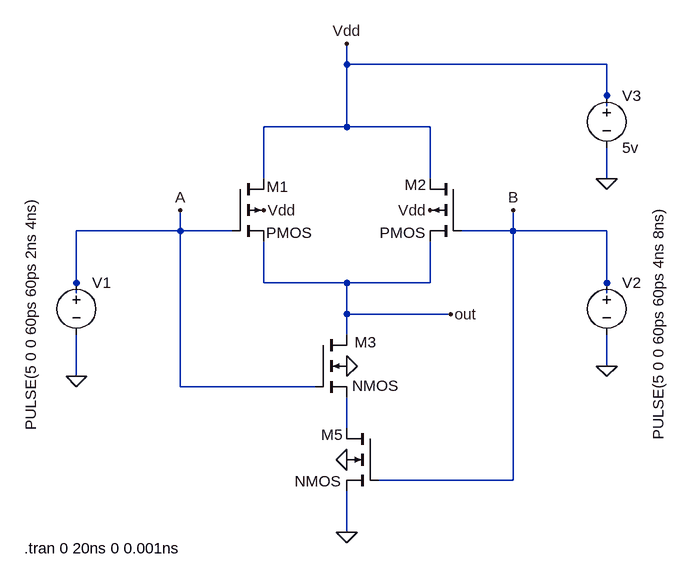
[diagram p0: schematic NAND.asc]
NAND.asc, the LTspice schematic file:
Version 4
SHEET 1 1016 740
WIRE 160 -80 160 -112
WIRE 560 -80 160 -80
WIRE 560 -32 560 -80
WIRE 560 -16 560 -32
WIRE 160 16 160 -80
WIRE 160 16 32 16
WIRE 288 16 160 16
WIRE 32 96 32 16
WIRE 288 96 288 16
WIRE 560 96 560 48
WIRE -96 176 -96 144
WIRE -96 176 -256 176
WIRE -16 176 -96 176
WIRE 416 176 416 144
WIRE 416 176 336 176
WIRE 560 176 416 176
WIRE -256 256 -256 176
WIRE 32 256 32 192
WIRE 160 256 32 256
WIRE 288 256 288 192
WIRE 288 256 160 256
WIRE 560 256 560 176
WIRE -256 272 -256 256
WIRE 560 272 560 256
WIRE 160 304 160 256
WIRE 320 304 160 304
WIRE 160 336 160 304
WIRE 560 384 560 336
WIRE -256 400 -256 336
WIRE -96 416 -96 176
WIRE 112 416 -96 416
WIRE 160 480 160 432
WIRE 416 560 416 176
WIRE 416 560 208 560
WIRE 160 640 160 576
FLAG 160 640 0
FLAG 560 384 0
FLAG -256 400 0
FLAG 160 -112 Vdd
FLAG 32 144 Vdd
FLAG 288 144 Vdd
FLAG -96 144 A
FLAG 416 144 B
FLAG 560 96 0
FLAG 160 384 0
FLAG 160 528 0
FLAG 320 304 out
SYMBOL voltage -256 240 R0
WINDOW 3 -70 -116 VRight 2
WINDOW 123 0 0 Left 0
WINDOW 39 0 0 Left 0
SYMATTR Value PULSE(5 0 0 60ps 60ps 2ns 4ns)
SYMATTR InstName V1
SYMBOL pmos4 -16 96 R0
WINDOW 0 53 12 Left 2
WINDOW 3 52 83 Left 2
SYMATTR InstName M1
SYMATTR Value2 l=0.6u w=6u
SYMBOL pmos4 336 96 M0
WINDOW 0 53 9 Left 2
WINDOW 3 55 83 Left 2
SYMATTR InstName M2
SYMATTR Value2 l=0.6u w=6u
SYMBOL nmos4 112 336 R0
WINDOW 0 60 11 Left 2
WINDOW 3 56 78 Left 2
SYMATTR InstName M3
SYMATTR Value2 l=0.6u w=3u
SYMBOL nmos4 208 480 M0
WINDOW 0 54 10 Left 2
WINDOW 3 56 81 Left 2
SYMATTR InstName M5
SYMATTR Value2 l=0.6u w=3u
SYMBOL voltage 560 -48 R0
WINDOW 123 0 0 Left 0
WINDOW 39 0 0 Left 0
SYMATTR InstName V3
SYMATTR Value 5v
SYMBOL voltage 560 240 R0
WINDOW 3 79 -101 VRight 2
WINDOW 123 0 0 Left 0
WINDOW 39 0 0 Left 0
SYMATTR Value PULSE(5 0 0 60ps 60ps 4ns 8ns)
SYMATTR InstName V2
TEXT -336 664 Left 2 !.tran 0 20ns 0 0.001ns

The netlist it stands for:
* NAND.asc
V1 A 0 PULSE(5 0 0 60ps 60ps 2ns 4ns)
M1 Vdd A out Vdd PMOS l=0.6u w=6u
M2 Vdd B out Vdd PMOS l=0.6u w=6u
M3 out A N001 0 NMOS l=0.6u w=3u
M5 N001 B 0 0 NMOS l=0.6u w=3u
V3 Vdd 0 5v
V2 B 0 PULSE(5 0 0 60ps 60ps 4ns 8ns)
.model NMOS NMOS
.model PMOS PMOS
.lib standard.mos
.tran 0 20ns 0 0.001ns
.backanno
.end